# EAGLE schematic Lab Controller Board v04 (EAGLE 7.5.0)

## Sheet 1 of 2: LED Controller
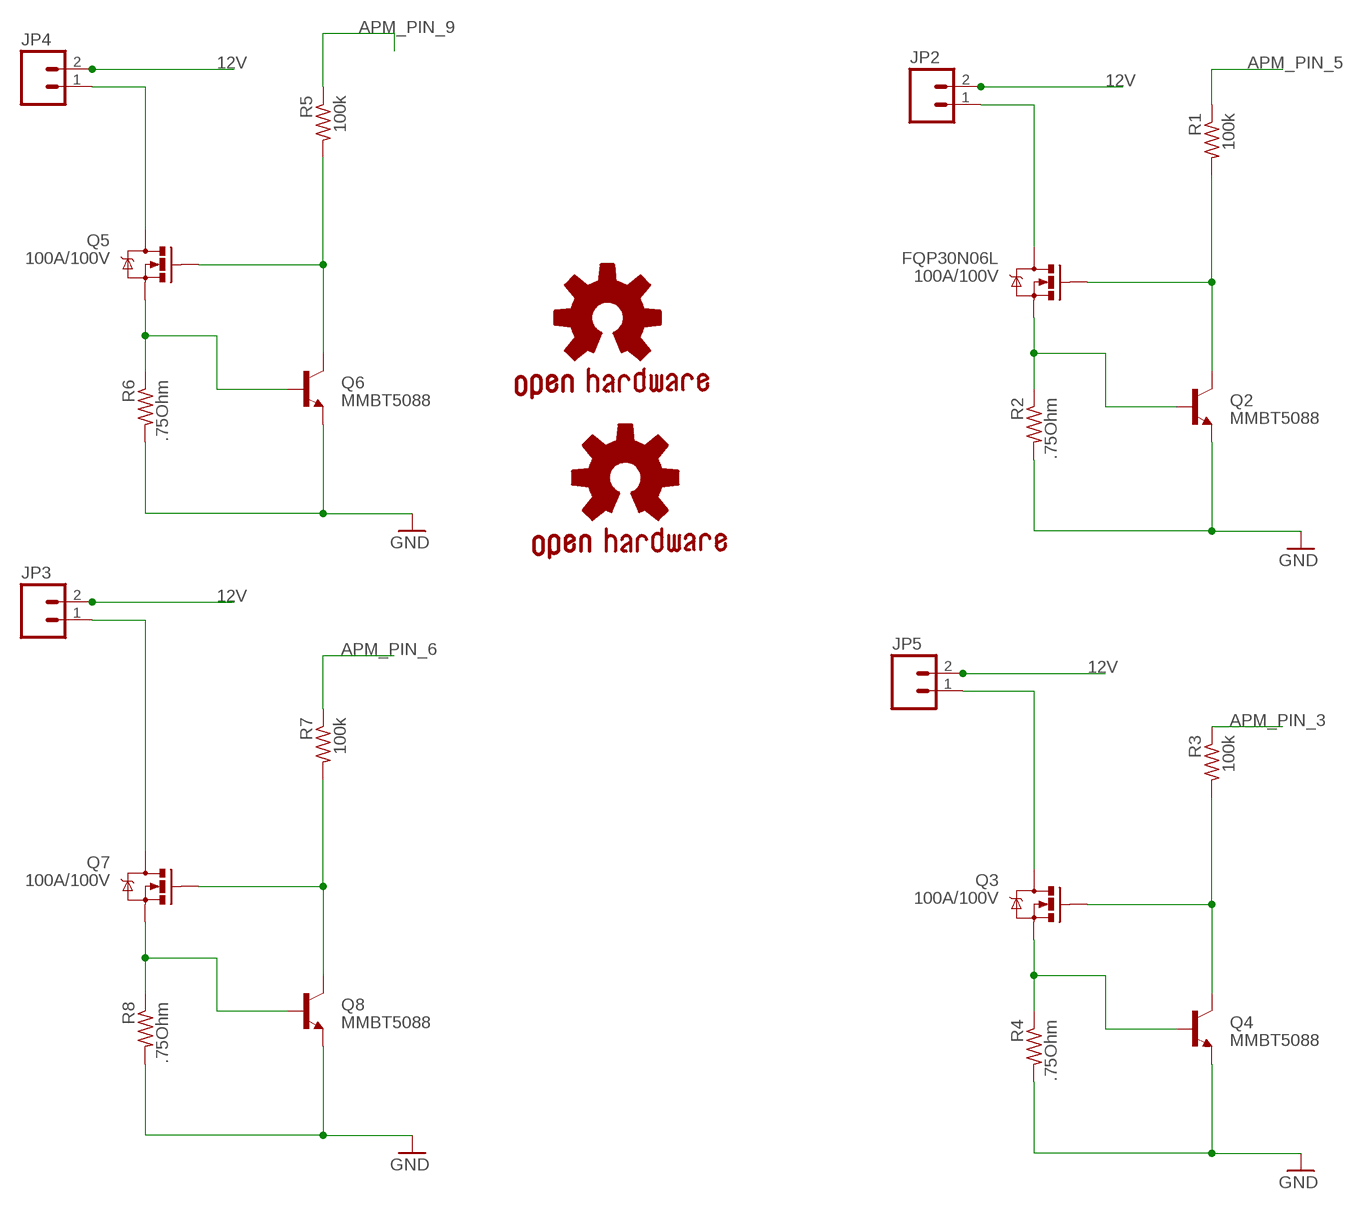
[diagram p0: schematic, sheet 1]

### Parts
FQP30N06L  100A/100V  MOSFET-NCHANNELPSMN7R0  [TO-263/D2PAK]
GOLD_ORB_SM1  OSHWLOGO_GOLD_ORB_MED  [OSHW1]
GOLD_ORB_SM2  OSHWLOGO_GOLD_ORB_SM  [OSHW2]
JP2  M025MM  [SCREWTERMINAL-5MM-2]
JP3  M025MM  [SCREWTERMINAL-5MM-2]
JP4  M025MM  [SCREWTERMINAL-5MM-2]
JP5  M025MM  [SCREWTERMINAL-5MM-2]
Q2  MMBT5088  TRANSISTOR_NPNMMBT5088  [SOT23-3]
Q3  100A/100V  MOSFET-NCHANNELPSMN7R0  [TO-263/D2PAK]
Q4  MMBT5088  TRANSISTOR_NPNMMBT5088  [SOT23-3]
Q5  100A/100V  MOSFET-NCHANNELPSMN7R0  [TO-263/D2PAK]
Q6  MMBT5088  TRANSISTOR_NPNMMBT5088  [SOT23-3]
Q7  100A/100V  MOSFET-NCHANNELPSMN7R0  [TO-263/D2PAK]
Q8  MMBT5088  TRANSISTOR_NPNMMBT5088  [SOT23-3]
R1  100k  R-US_R0805W  [R0805W]
R2  .75Ohm  R-US_0411/3V  [0411V]
R3  100k  R-US_R0805W  [R0805W]
R4  .75Ohm  R-US_0411/3V  [0411V]
R5  100k  R-US_R0805W  [R0805W]
R6  .75Ohm  R-US_0411/3V  [0411V]
R7  100k  R-US_R0805W  [R0805W]
R8  .75Ohm  R-US_0411/3V  [0411V]

### Nets
12V: JP2.2 JP3.2 JP4.2 JP5.2 ; also sheet 2
APM_PIN_3: R3.1 ; also sheet 2
APM_PIN_5: R1.1 ; also sheet 2
APM_PIN_6: R7.1 ; also sheet 2
APM_PIN_9: R5.1 ; also sheet 2
FET_SOURCE: FQP30N06L.3(S) Q2.1(B) R2.1
FET_SOURCE1: Q3.3(S) Q4.1(B) R4.1
FET_SOURCE2: Q5.3(S) Q6.1(B) R6.1
FET_SOURCE3: Q7.3(S) Q8.1(B) R8.1
GND: Q2.2(E) Q4.2(E) Q6.2(E) Q8.2(E) R2.2 R4.2 R6.2 R8.2 ; also sheet 2
LED_DRAIN: FQP30N06L.2(D) JP2.1
LED_DRAIN1: JP5.1 Q3.2(D)
LED_DRAIN2: JP4.1 Q5.2(D)
LED_DRAIN3: JP3.1 Q7.2(D)
PWM_B: FQP30N06L.1(G) Q2.3(C) R1.2
PWM_B1: Q3.1(G) Q4.3(C) R3.2
PWM_B2: Q5.1(G) Q6.3(C) R5.2
PWM_B3: Q7.1(G) Q8.3(C) R7.2

## Sheet 2 of 2: My Arduino
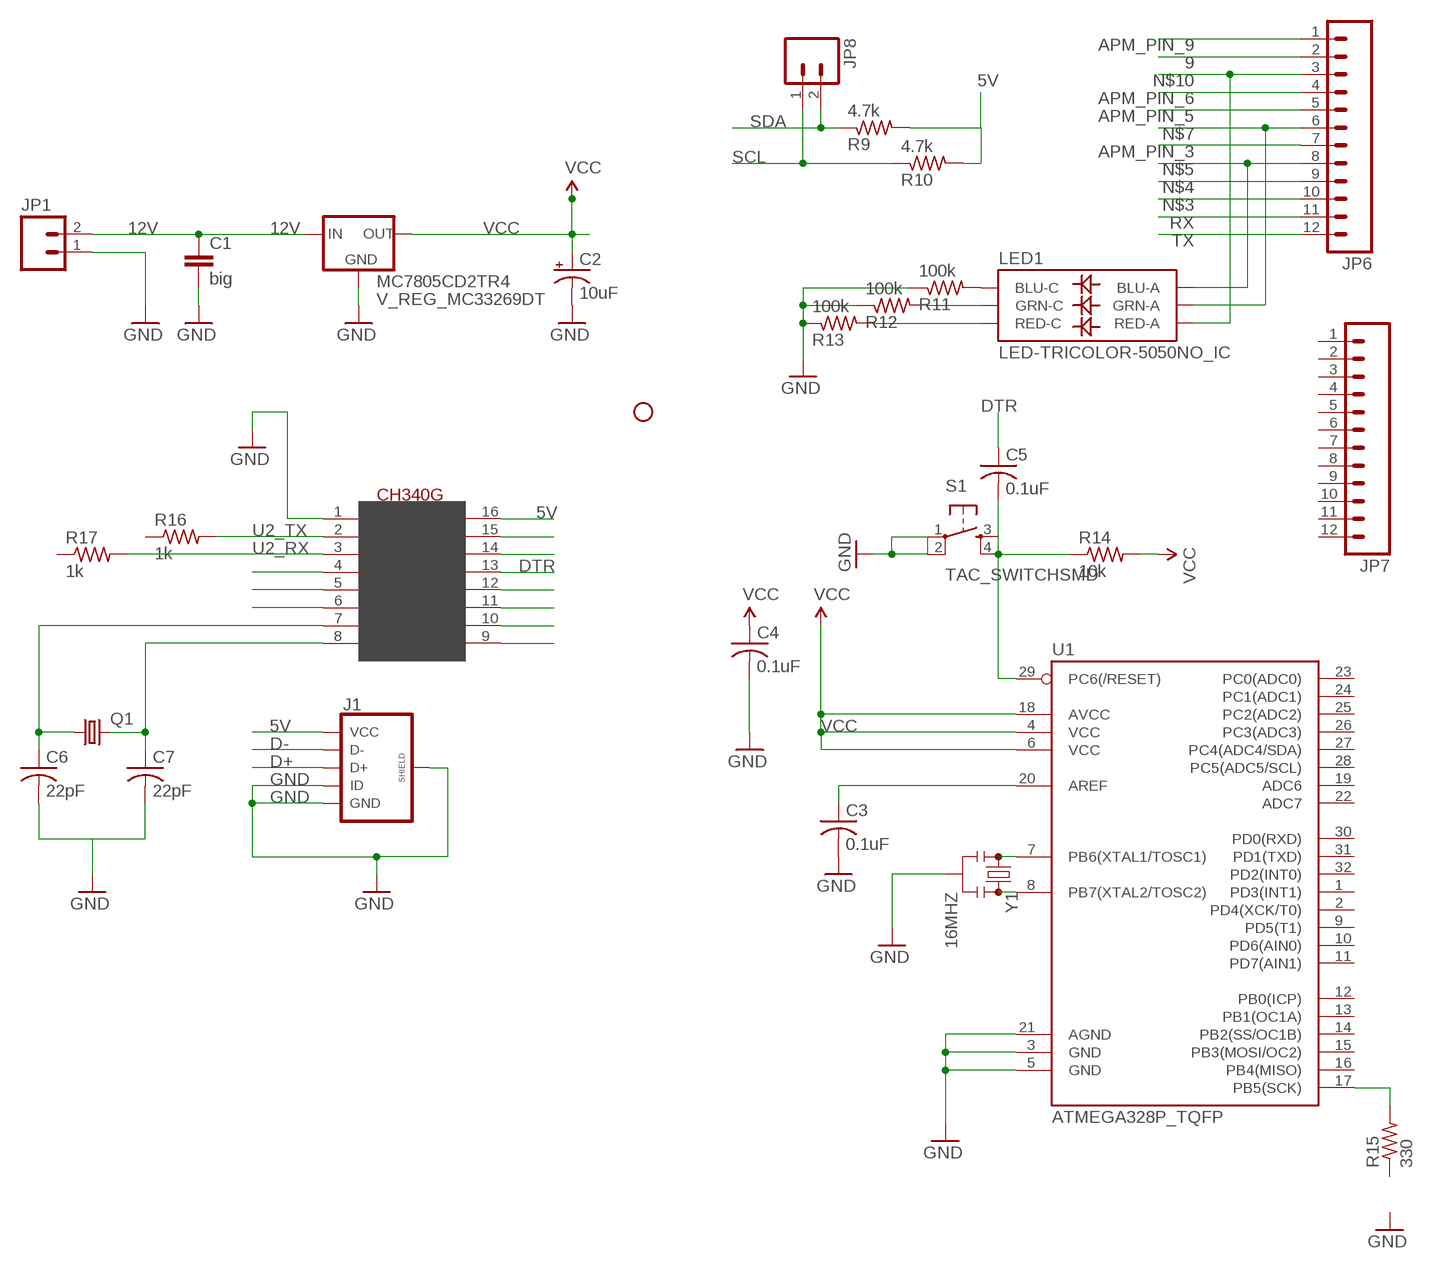
[diagram p1: schematic, sheet 2]

### Parts
C1  big  CAPPTH1  [CAP-PTH-5MM]
C2  10uF  CAP_POL3528  [EIA3528]
C3  0.1uF  C-USC0402  [C0402]
C4  0.1uF  C-USC0402  [C0402]
C5  0.1uF  C-USC0402  [C0402]
C6  22pF  C-USC0402  [C0402]
C7  22pF  C-USC0402  [C0402]
J1  USB_MICROB_PLUGCONN-11752  [USB-B-MICRO-SMD_V03]
JP1  M025MM  [SCREWTERMINAL-5MM-2]
JP6  M12PTH  [1X12]
JP7  M12PTH  [1X12]
JP8  M02LOCK  [1X02_LOCK]
LED1  LED-TRICOLOR-5050NO_IC  [LED-TRICOLOR-5050]
MC7805CD2TR4  V_REG_MC33269DT  [DPAK]
Q1  CRYSTALHC49UP  [HC49UP]
R9  4.7k  R-US_M0805  [M0805]
R10  4.7k  R-US_M0805  [M0805]
R11  100k  R-US_R0805W  [R0805W]
R12  100k  R-US_R0805W  [R0805W]
R13  100k  R-US_R0805W  [R0805W]
R14  10k  R-US_R0402  [R0402]
R15  330  R-US_R0402  [R0402]
R16  1k  R-US_R0402  [R0402]
R17  1k  R-US_R0402  [R0402]
S1  TAC_SWITCHSMD  [TACTILE-SWITCH-SMD]
STANDOFF1  STAND-OFF  [STAND-OFF]
U1  ATMEGA328P_TQFP  [TQFP32-08]
U2  CH340G  [SOIC16]
Y1  16MHZ  RESONATOR16MHZ  [RESONATOR-SMD]

### Nets
5V: J1.VBUS(VCC) R9.2 R10.2 U2.16(VCC)
9: JP6.2
12V: C1.1 JP1.2 MC7805CD2TR4.3(IN) ; also sheet 1
APM_PIN_3: JP6.7 ; also sheet 1
APM_PIN_5: JP6.5 ; also sheet 1
APM_PIN_6: JP6.4 ; also sheet 1
APM_PIN_9: JP6.1 ; also sheet 1
D+: J1.D+ U2.5(D+)
D-: J1.D- U2.6(D-)
DTR: C5.1 U2.13(DTR)
GND: C1.2 C2.C(-) C3.2 C4.2 C6.2 C7.2 J1.GND J1.ID J1.SHIELD1(SHIELD) J1.SHIELD2(SHIELD) J1.SHIELD3(SHIELD) JP1.1 MC7805CD2TR4.1(GND) R11.1 R12.1 R13.1 S1.1 S1.2 U1.3(GND) U1.5(GND) U1.21(AGND) U2.1(GND) Y1.2 ; also sheet 1
N$1: C3.1 U1.20(AREF)
N$2: U1.7(PB6(XTAL1/TOSC1)) Y1.1
N$3: JP6.10
N$4: JP6.9
N$5: JP6.8 LED1.3(BLU-A)
N$6: LED1.4(BLU-C) R11.2
N$7: JP6.6 LED1.1(GRN-A)
N$8: LED1.6(GRN-C) R12.2
N$9: LED1.5(RED-C) R13.2
N$10: JP6.3 LED1.2(RED-A)
N$11: U1.8(PB7(XTAL2/TOSC2)) Y1.3
N$13: C5.2 R14.1 S1.3 S1.4 U1.29(PC6(/RESET))
N$14: R15.2 U1.17(PB5(SCK))
N$30: U2.9(CTS) U2.10(DSR) U2.11(RI) U2.12(DCD) U2.14(RTS) U2.15(RS232)
N$32: C6.1 C7.1 Q1.1 Q1.2 U2.4(V3) U2.7(XI) U2.8(XO)
RX: JP6.11
SCL: JP8.1 R10.1
SDA: JP8.2 R9.1
TX: JP6.12
U2_RX: R17.2 U2.3(RX)
U2_TX: R16.2 U2.2(TX)
VCC: C2.A(+) C4.1 MC7805CD2TR4.4(OUT) R14.2 U1.4(VCC) U1.6(VCC) U1.18(AVCC)
Unconnected: JP7.1 JP7.2 JP7.3 JP7.4 JP7.5 JP7.6 JP7.7 JP7.8 JP7.9 JP7.10 JP7.11 JP7.12 R15.1 R16.1 R17.1 U1.1(PD3(INT1)) U1.2(PD4(XCK/T0)) U1.9(PD5(T1)) U1.10(PD6(AIN0)) U1.11(PD7(AIN1)) U1.12(PB0(ICP)) U1.13(PB1(OC1A)) U1.14(PB2(SS/OC1B)) U1.15(PB3(MOSI/OC2)) U1.16(PB4(MISO)) U1.19(ADC6) U1.22(ADC7) U1.23(PC0(ADC0)) U1.24(PC1(ADC1)) U1.25(PC2(ADC2)) U1.26(PC3(ADC3)) U1.27(PC4(ADC4/SDA)) U1.28(PC5(ADC5/SCL)) U1.30(PD0(RXD)) U1.31(PD1(TXD)) U1.32(PD2(INT0))

## Library data of the parts
C1 = SparkFun-Passives:CAP: Capacitor Standard 0603 ceramic capacitor, and 0.1" leaded capacitor.
C2 = SparkFun-Capacitors:CAP_POL: Capacitor Polarized These are standard SMD and PTH capacitors. Normally 10uF, 47uF, and 100uF in electrolytic and tantalum varieties. Always verify the external diameter of the through hole cap, it varies with capacity, voltage, and manufacturer. The EIA devices should be standard.
C3-C7 = resistor:C-US: CAPACITOR, American symbol
FQP30N06L Q3 Q5 Q7 = SparkFun-DiscreteSemi:MOSFET-NCHANNEL: Common NMOSFET Parts MFG P/N Store ID Prod ID FDD8780 TRANS-09984 SI7820DN TRANS-11055 FDS6630A IC-08089 2N7002PW TRANS-11151 FQP30N06L COM-10213 TRANS-10060 BSS123LT1G TRANS-08345 BSS138 TRANS-00830 BS170 2N7000; PROD_ID: TRANS-12437
GOLD_ORB_SM1 GOLD_ORB_SM2 = bfl:OSHWLOGO: These are Open-Source Hardware logos.
J1 = SparkFun-Connectors:USB_MICROB_PLUG: USB Micro-B connectors Some male, some female. Watch your step!; PROD_ID: CONN-11752
JP1-JP5 = SparkFun-Connectors:M02: Standard 2-pin 0.1" header. Use with - straight break away headers ( PRT-00116) - right angle break away headers (PRT-00553) - swiss pins (PRT-00743) - machine pins (PRT-00117) - female headers (PRT-00115) Molex polarized connector foot print use with: PRT-08233 with associated crimp pins and housings. 2.54_SCREWTERM for use with PRT-10571. 3.5mm Screw Terminal footprints for PRT-08084 5mm Screw Terminal footprints for use with PRT-08432; STOREFRONT_ID: PRT-08432
JP6 JP7 = SparkFun-Connectors:M12: Header 12 Standard 12-pin 0.1" header. Use with straight break away headers (SKU : PRT-00116), right angle break away headers (PRT-00553), swiss pins (PRT-00743), machine pins (PRT-00117), and female headers (PRT-00115).
JP8 = SparkFun-Connectors:M02: Standard 2-pin 0.1" header. Use with - straight break away headers ( PRT-00116) - right angle break away headers (PRT-00553) - swiss pins (PRT-00743) - machine pins (PRT-00117) - female headers (PRT-00115) Molex polarized connector foot print use with: PRT-08233 with associated crimp pins and housings. 2.54_SCREWTERM for use with PRT-10571. 3.5mm Screw Terminal footprints for PRT-08084 5mm Screw Terminal footprints for use with PRT-08432
LED1 = SparkFun-LED:LED-TRICOLOR-5050
MC7805CD2TR4 = SparkFun-PowerIC:V_REG_MC33269
Q1 = crystal:CRYSTAL: CRYSTAL; OC_FARNELL: unknown; OC_NEWARK: unknown
Q2 Q4 Q6 Q8 = SparkFun-DiscreteSemi:TRANSISTOR_NPN: Generic NPN BJT MMBT2222A - TRANS-08049 (SOT-23, 1A 40V) MPSA42 - TRANS-09116 (SOT-23, 500mA 300V) MMBT5088LT1G - TRANS-11160 (SOT-23, 50 mA 30V) BC547 - COM-08928 <http://www.sparkfun.com/products/8928> (TO-92 45V 100mA) (1.Collector 2.Base 3.Emitter) 2N3904 - COM-00521 <http://www.sparkfun.com/products/521> (TO-92 40V 200mA) (1.Emitter 2.Base 3.Collector) P2N2222A - COM-12852 <http://www.sparkfun.com/products/12852> (TO-92 40V 600mA) (1.Collector 2.Base 3.Emitter); PROD_ID: TRANS-11160
R1-R17 = resistor:R-US_: RESISTOR, American symbol
S1 = SparkFun-Retired:TAC_SWITCH: Momentary Switch Button commonly used for reset or general input. Spark Fun Electronics SKU : COM-00097 SMT- SWCH-08247; PROD_ID: SWCH-08247
STANDOFF1 = SparkFun-Electromechanical:STAND-OFF: #4 Stand Off This is the mechanical footprint for a #4 phillips button head screw. Use the keepout ring to avoid running the screw head into surrounding components. SKU : PRT-00447
U1 = SparkFun-DigitalIC:ATMEGA328P_TQFP; PROD_ID: IC-09069
U2 = usb-serial:CH340G
Y1 = SparkFun-FreqCtrl:RESONATOR: Resonator Small SMD resonator. Used, eg, on the Arduino Pro/ Pro Mini boards. 8MHz- XTAL-08895 16MHz- XTAL-08900; PROD_ID: XTAL-08900